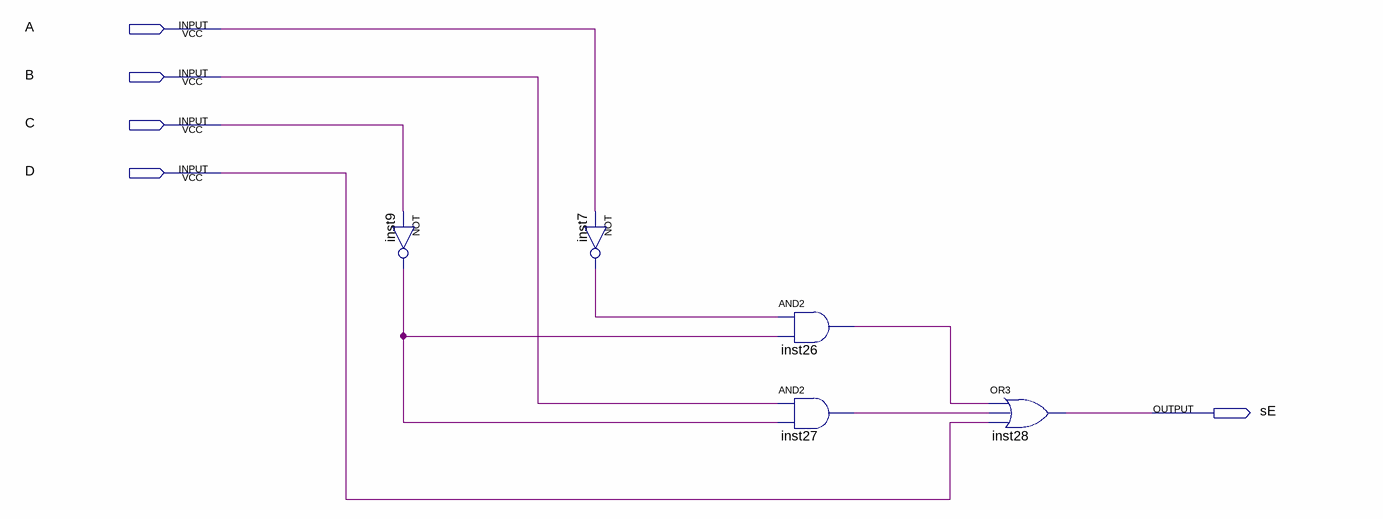
[diagram p0: schematic sheet]
// Quartus schematic decodificadorParcelaSaidaE.bdf as structural Verilog: 5 symbols, 5 pins
module decodificadorParcelaSaidaE (
  input  A,
  input  B,
  input  C,
  input  D,
  output sE
);

  wire inst7_out, inst9_out, inst26_out, inst27_out;

  not inst9 (inst9_out, C);
  not inst7 (inst7_out, A);
  and inst26 (inst26_out, inst7_out, inst9_out);
  and inst27 (inst27_out, B, inst9_out);
  or inst28 (sE, inst26_out, inst27_out, D);
endmodule
